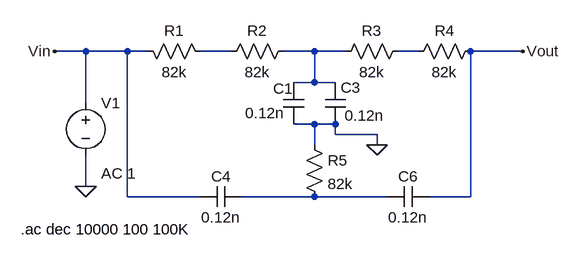
[diagram p0: schematic Draft6.asc]
Draft6.asc, the LTspice schematic file:
Version 4
SHEET 1 880 680
WIRE -32 80 -80 80
WIRE 32 80 -32 80
WIRE 64 80 32 80
WIRE 192 80 144 80
WIRE 320 80 272 80
WIRE 368 80 320 80
WIRE 480 80 448 80
WIRE 640 80 560 80
WIRE 320 128 320 80
WIRE 320 128 288 128
WIRE 352 128 320 128
WIRE -32 160 -32 80
WIRE 320 192 288 192
WIRE 352 192 320 192
WIRE 352 208 352 192
WIRE 416 208 352 208
WIRE 320 224 320 192
WIRE 416 224 416 208
WIRE -32 288 -32 240
WIRE 32 304 32 80
WIRE 144 304 32 304
WIRE 320 304 208 304
WIRE 432 304 320 304
WIRE 560 304 560 80
WIRE 560 304 496 304
FLAG 416 224 0
FLAG -32 288 0
FLAG 640 80 Vout
FLAG -80 80 Vin
SYMBOL res 48 64 M90
WINDOW 0 0 56 VBottom 2
WINDOW 3 32 56 VTop 2
SYMATTR InstName R1
SYMATTR Value 82k
SYMBOL res 288 64 R90
WINDOW 0 0 56 VBottom 2
WINDOW 3 32 56 VTop 2
SYMATTR InstName R2
SYMATTR Value 82k
SYMBOL res 464 64 R90
WINDOW 0 0 56 VBottom 2
WINDOW 3 32 56 VTop 2
SYMATTR InstName R3
SYMATTR Value 82k
SYMBOL res 576 64 R90
WINDOW 0 0 56 VBottom 2
WINDOW 3 32 56 VTop 2
SYMATTR InstName R4
SYMATTR Value 82k
SYMBOL res 304 208 R0
SYMATTR InstName R5
SYMATTR Value 82k
SYMBOL cap 272 128 R0
WINDOW 0 -16 9 Left 2
WINDOW 3 -59 47 Left 2
SYMATTR InstName C1
SYMATTR Value 0.12n
SYMBOL cap 336 128 R0
WINDOW 3 30 51 Left 2
SYMATTR InstName C3
SYMATTR Value 0.12n
SYMBOL cap 208 288 R90
WINDOW 0 0 32 VBottom 2
WINDOW 3 32 32 VTop 2
SYMATTR InstName C4
SYMATTR Value 0.12n
SYMBOL cap 496 288 R90
WINDOW 0 0 32 VBottom 2
WINDOW 3 32 32 VTop 2
SYMATTR InstName C6
SYMATTR Value 0.12n
SYMBOL voltage -32 144 R0
WINDOW 123 24 124 Left 2
WINDOW 39 0 0 Left 0
SYMATTR InstName V1
SYMATTR Value ""
SYMATTR Value2 AC 1
TEXT -132 354 Left 2 !.ac dec 10000 100 100K

The netlist it stands for:
* Draft6.asc
R1 Vin N001 82k
R2 N002 N001 82k
R3 N003 N002 82k
R4 Vout N003 82k
R5 0 N004 82k
C1 N002 0 0.12n
C3 N002 0 0.12n
C4 N004 Vin 0.12n
C6 Vout N004 0.12n
V1 Vin 0 AC 1
.ac dec 10000 100 100K
.backanno
.end